# EAGLE design hub_exterior (EAGLE 7.6.0)
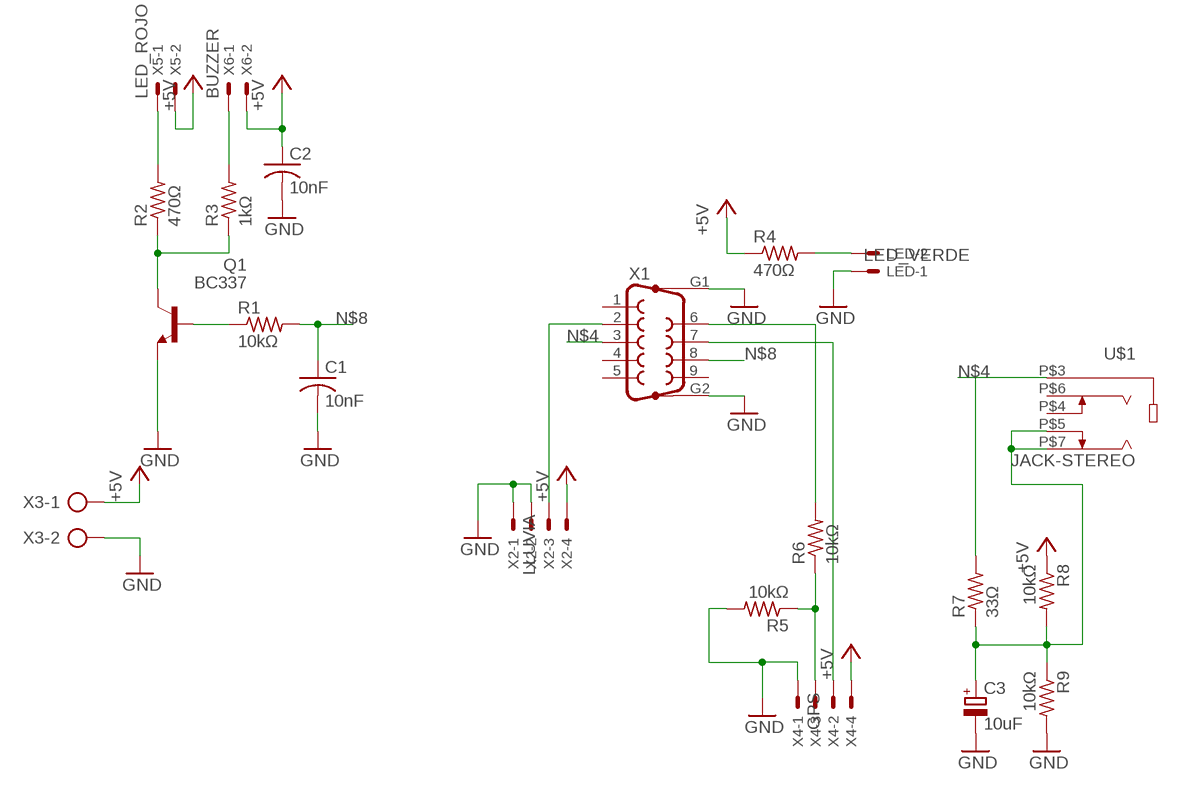
[diagram p0: schematic, sheet 1]

## Parts
C1  10nF  C-US050-025X075  [C050-025X075]
C2  10nF  C-US050-025X075  [C050-025X075]
C3  10uF  CPOL-EUE2.5-5  [E2,5-5]
LED  LED_VERDE  22-23-2021  [22-23-2021]
Q1  BC337  [TO92]
R1  10kΩ  R-US_0207/7  [0207/7]
R2  470Ω  R-US_0207/7  [0207/7]
R3  1kΩ  R-US_0207/7  [0207/7]
R4  470Ω  R-US_0207/7  [0207/7]
R5  10kΩ  R-US_0207/7  [0207/7]
R6  10kΩ  R-US_0207/15  [0207/15]
R7  33Ω  R-US_0207/7  [0207/7]
R8  10kΩ  R-US_0207/7  [0207/7]
R9  10kΩ  R-US_0207/7  [0207/7]
U$1  JACK-STEREO  [SPC21348]
X1  F09HP  [F09HP]
X2  LLUVIA  22-23-2041  [22-23-2041]
X3  AK500/2  [AK500/2]
X4  GPS  22-23-2041  [22-23-2041]
X5  LED_ROJO  22-23-2021  [22-23-2021]
X6  BUZZER  22-23-2021  [22-23-2021]

## Nets
+5V: C2.1 R4.1 R8.1 X2.4 X3.1 X4.4 X5.2 X6.2
GND: C1.2 C2.2 C3.- LED.1 Q1.1(E) R5.2 R9.2 X1.G1 X1.G2 X2.1 X2.2 X3.2 X4.1
N$1: Q1.2(B) R1.1
N$2: LED.2 R4.2
N$3: Q1.3(C) R2.1 R3.1
N$4: R7.2 U$1.P$3 X1.3
N$5: R2.2 X5.1
N$6: R3.2 X6.1
N$7: X1.2 X2.3
N$8: C1.1 R1.2 X1.8
N$10: X1.7 X4.2
N$11: R6.2 X1.6
N$12: R5.1 R6.1 X4.3
N$14: C3.+ R7.1 R8.2 R9.1 U$1.P$5 U$1.P$7
Unconnected: U$1.P$4 U$1.P$6 X1.1 X1.4 X1.5 X1.9

## Library data of the parts
C1 C2 = rcl:C-US: CAPACITOR, American symbol
C3 = rcl:CPOL-EU: POLARIZED CAPACITOR, European symbol
LED X5 X6 = con-molex:22-23-2021: .100" (2.54mm) Center Header - 2 Pin; MF: MOLEX; MPN: 22-23-2021; OC_FARNELL: 1462926; OC_NEWARK: 25C3832
Q1 = transistor-npn:BC337*: NPN Transistor
R1-R9 = rcl:R-US_: RESISTOR, American symbol
U$1 = con-jack:JACK-STEREO
X1 = con-subd:F09HP: SUB-D; OC_FARNELL: unknown; OC_NEWARK: unknown
X2 X4 = con-molex:22-23-2041: .100" (2.54mm) Center Header - 4 Pin; MF: MOLEX; MPN: 22-23-2041; OC_FARNELL: 1462920; OC_NEWARK: 38C0355
X3 = con-ptr500:AK500/2: CONNECTOR; OC_FARNELL: unknown; OC_NEWARK: unknown

## Board
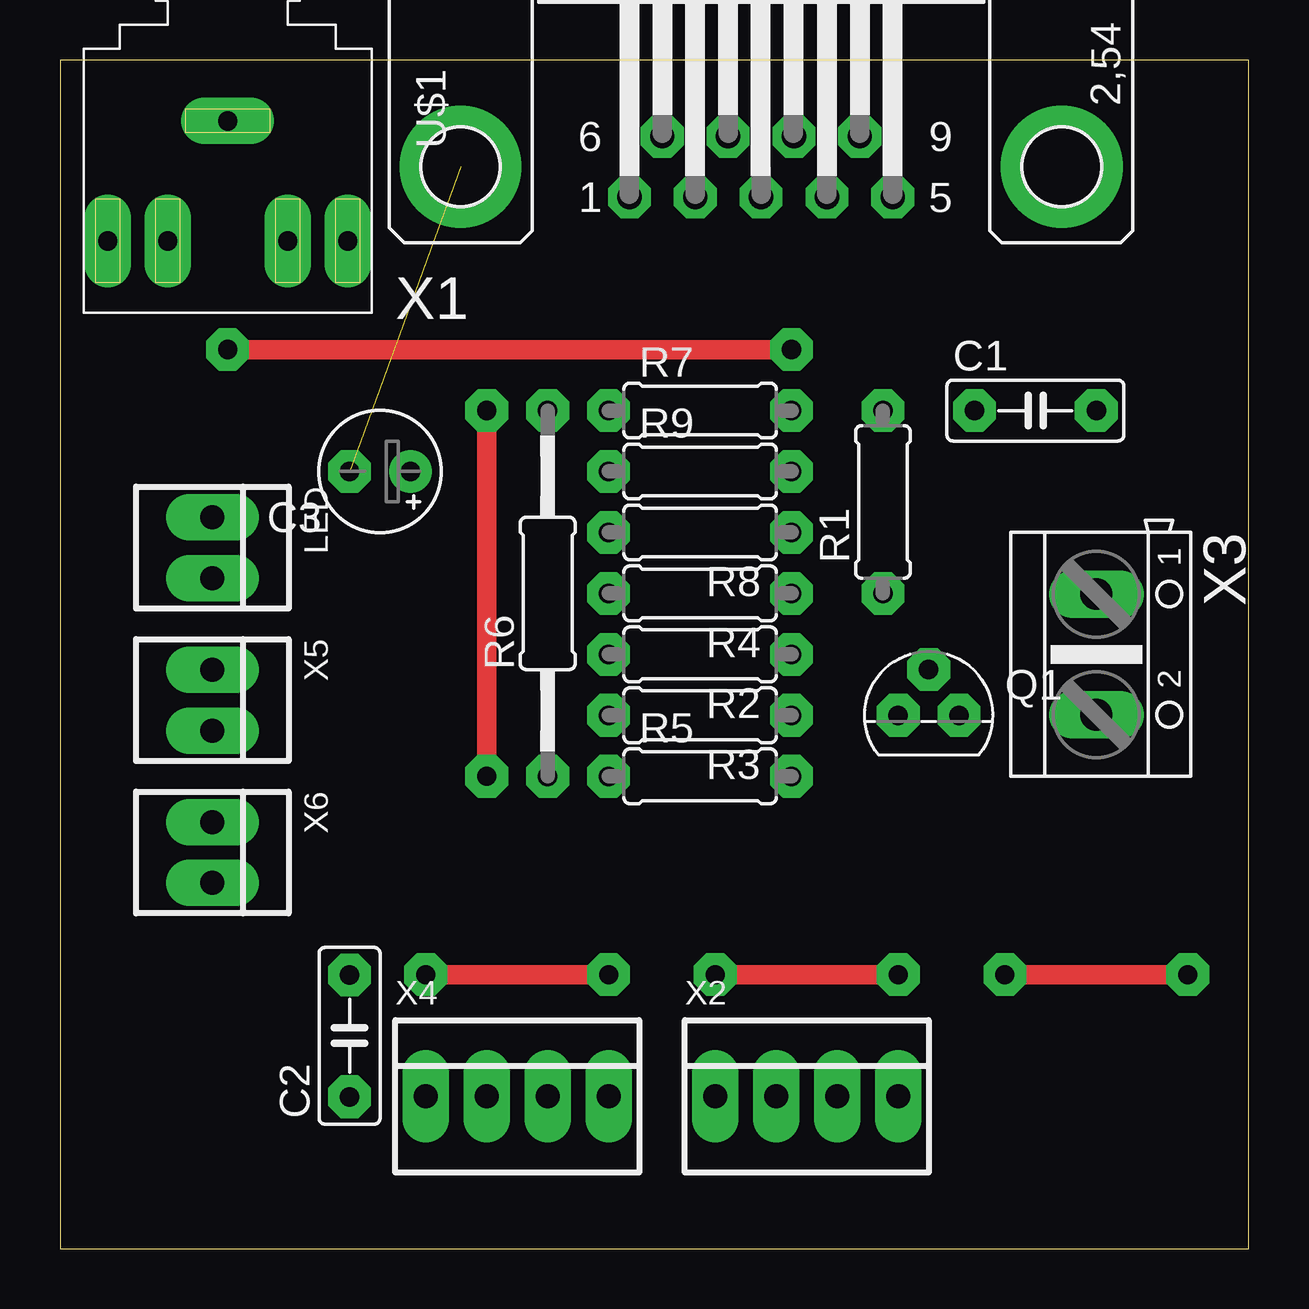
[diagram p1: board, top side]
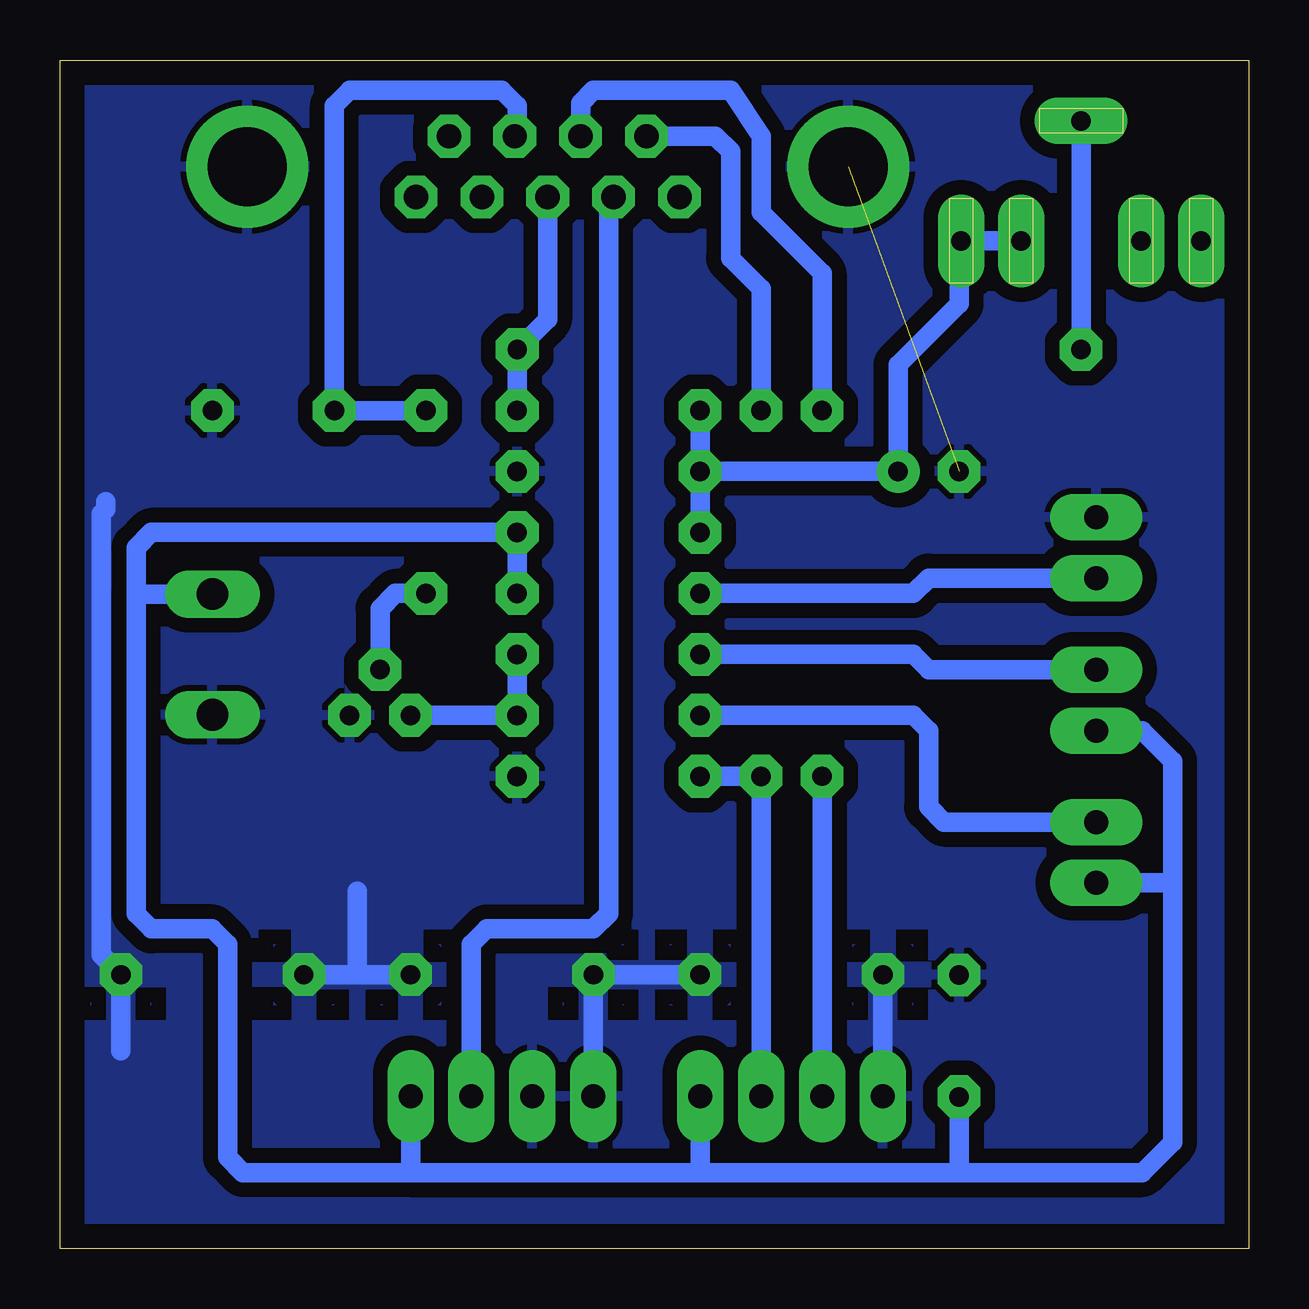
[diagram p2: board, bottom side, seen from below]

Size 49.53 x 49.53 mm. Coordinates in mm from the lower left corner, seen from the top.
Outline: 0,0 49.53,0 49.53,49.53 0,49.53 0,0
Copper layers (1*16): Top 0.035mm / dielectric 1.5mm / Bottom 0.035mm
Design rules "default": minimum track width 10mil, minimum drill 24mil, track to track 8mil, track to pad 8mil, pad to pad 8mil, via to via 8mil, smd to smd 8mil, copper to edge 40mil, drill to drill 8mil, minimum pad ring 10mil, minimum via ring 8mil, stop-mask expansion 4mil, vias tented up to drill 0mil, thermal gap 10mil

### Footprints (pad centres in the part's own frame; a part is rotated, then mirrored left to right if it is on the bottom)
C050-025X075 = drill 0.813 pad 1.778 octagon: 1 -2.54,0; 2 2.54,0
E2,5-5 = drill 0.813 pad 1.778: + -1.27,0 | drill 0.813 pad 1.778 octagon: - 1.27,0
22-23-2021 = drill 1 pad 1.93 long: 1 -1.27,0; 2 1.27,0
TO92 = drill 0.813 pad 1.778 octagon: 1 1.27,0; 2 0,1.905; 3 -1.27,0
0207/7 = drill 0.813 pad 1.778 octagon: 1 -3.81,0; 2 3.81,0
0207/15 = drill 0.813 pad 1.778 octagon: 1 -7.62,0; 2 7.62,0
SPC21348 = drill 0.8 pad 1.93 long: P$3 0,0; P$4 5,-2.5; P$5 5,2.5; P$6 5,-5; P$7 5,5
F09HP = drill 1.016 pad 1.778 octagon: 1 -5.486,-1.27; 2 -2.743,-1.27; 3 0,-1.27; 4 2.743,-1.27; 5 5.486,-1.27; 6 -4.115,1.27; 7 -1.372,1.27; 8 1.372,1.27; 9 4.115,1.27 | drill 3.302 pad 5.08: G1 -12.522,0; G2 12.522,0
22-23-2041 = drill 1 pad 1.93 long: 1 -3.81,0; 2 -1.27,0; 3 1.27,0; 4 3.81,0
AK500/2 = drill 1.321 pad 1.93 long: 1 -2.515,0; 2 2.515,0

### Placement (x,y rotation side)
C1  40.64,34.92 0 top
C2  12.06,8.87 90 top
C3  13.34,32.38 180 top
LED  6.35,29.21 270 top
Q1  36.2,22.23 0 top
R1  34.29,31.11 90 top
R2  26.67,24.77 180 top
R3  26.67,22.23 180 top
R4  26.67,27.3 180 top
R5  26.67,19.68 0 top
R6  20.32,27.3 90 top
R7  26.67,34.92 0 top
R8  26.67,29.84 180 top
R9  26.67,32.38 0 top
U$1  6.99,46.99 270 top
X1  29.21,45.09 0 top
X2  31.11,6.35 0 top
X3  43.18,24.77 270 top
X4  19.05,6.35 0 top
X5  6.35,22.86 270 top
X6  6.35,16.51 270 top

### Tracks (layer width: path | path; a pad name or v marks a point on that pad's centre or on a via)
+5V
  Bottom 0.813: 34.92,3.17 22.86,3.17 | X2.4 34.92,3.17 | X4.4 22.86,3.17 | 3.17,15.24 3.17,20.32 4.45,21.59 X5.2 | X6.2 3.17,15.24 | 22.86,3.17 12.06,3.17 | 12.06,3.17 4.45,3.17 3.17,4.45 3.17,15.24 | R4.1 R8.1 45.72,29.84 46.35,29.21 46.35,27.3 | 46.35,27.3 46.35,13.96 45.72,13.32 43.18,13.32 42.55,12.69 42.55,3.81 41.91,3.17 34.92,3.17 | C2.1 12.06,3.17 | X3.1 46.33,27.28 46.35,27.3
GND  (via drill 0.8 pad 1.78)  (1 unrouted)
  Top 0.813: v34.92,11.42 v27.3,11.42 | v22.86,11.42 v15.24,11.42 | v39.37,11.42 v46.99,11.42
  Bottom 0.813: 46.99,8.26 v46.99,11.42 47.81,12.24 47.81,30.62 47.62,30.81 47.62,31.11 | v34.92,11.42 37.15,11.42 | v39.37,11.42 37.15,11.42 | 37.15,11.42 37.15,14.9 | X2.1 v27.3,11.42 v22.86,11.42 | v15.24,11.42 X4.1
  pour Bottom (isolate 0.61, rank 6): -2.54,50.16 -2.54,-1.27 50.8,-1.27 50.8,50.16
N$1
  Bottom 0.813: R1.1 35.56,27.3 36.2,26.67 Q1.2
N$2
  Bottom 0.813: R4.2 13.97,27.3 13.34,27.94 LED.2
N$3
  Bottom 0.813: Q1.3 R3.1 R2.1
N$4  (via drill 0.8 pad 1.78)
  Top 0.813: v6.99,37.47 v30.48,37.47
  Bottom 0.813: X1.3 29.21,38.73 v30.48,37.47 R7.2 | U$1.P$3 v6.99,37.47
N$5
  Bottom 0.813: X5.1 13.34,24.13 13.97,24.77 R2.2
N$6
  Bottom 0.813: R3.2 13.97,22.23 13.34,21.59 13.34,18.41 12.7,17.78 X6.1
N$7
  Bottom 0.813: X1.2 26.67,43.81 26.67,13.96 27.3,13.32 31.75,13.32 32.38,12.69 X2.3
N$8
  Bottom 0.813: X1.8 30.48,46.35 30.48,47.62 31.11,48.26 37.47,48.26 38.1,47.62 C1.1 R1.2
N$9
  pour Bottom (isolate 0.813): 16.51,12.69 13.97,12.69 13.97,10.15 16.51,10.15
  pour Bottom (isolate 0.813): 24.13,12.69 21.59,12.69 21.59,10.15 24.13,10.15
  pour Bottom (isolate 0.813): 28.57,12.69 26.04,12.69 26.04,10.15 28.57,10.15
  pour Bottom (isolate 0.813): 36.2,12.69 33.66,12.69 33.66,10.15 36.2,10.15
  pour Bottom (isolate 0.813): 40.64,12.69 37.79,12.69 38.1,10.15 40.64,10.15
  pour Bottom (isolate 0.813): 48.26,12.69 45.72,12.69 45.72,10.15 48.26,10.15
  pour Bottom (isolate 1.676, rank 4): 29.21,42.53 26.67,42.53 26.67,19.04 29.21,19.04
N$10  (via drill 0.8 pad 1.78)
  Top 0.813: v17.78,34.92 v17.78,19.68
  Bottom 0.813: X1.7 27.84,47.73 27.3,48.26 21.59,48.26 20.32,46.35 20.32,43.18 17.78,40.64 v17.78,34.92 | v17.78,19.68 X4.2
N$11
  Bottom 0.813: X1.6 22.23,46.35 21.59,45.72 21.59,41.27 20.32,40.01 R6.2
N$12
  Bottom 0.813: X4.3 R6.1 R5.1
N$14
  Bottom 0.813: R8.2 R9.1 | R7.1 R9.1 | 9.53,41.95 U$1.P$5 U$1.P$7 12.06,41.91 12.06,39.37 14.61,36.83 C3.+ R9.1